# Altium schematic sheet analog-encoder.SchDoc: Encoder Interface INC/1Vpp/Resolver
size A3; SheetNumber: 9; SheetTotal: 18
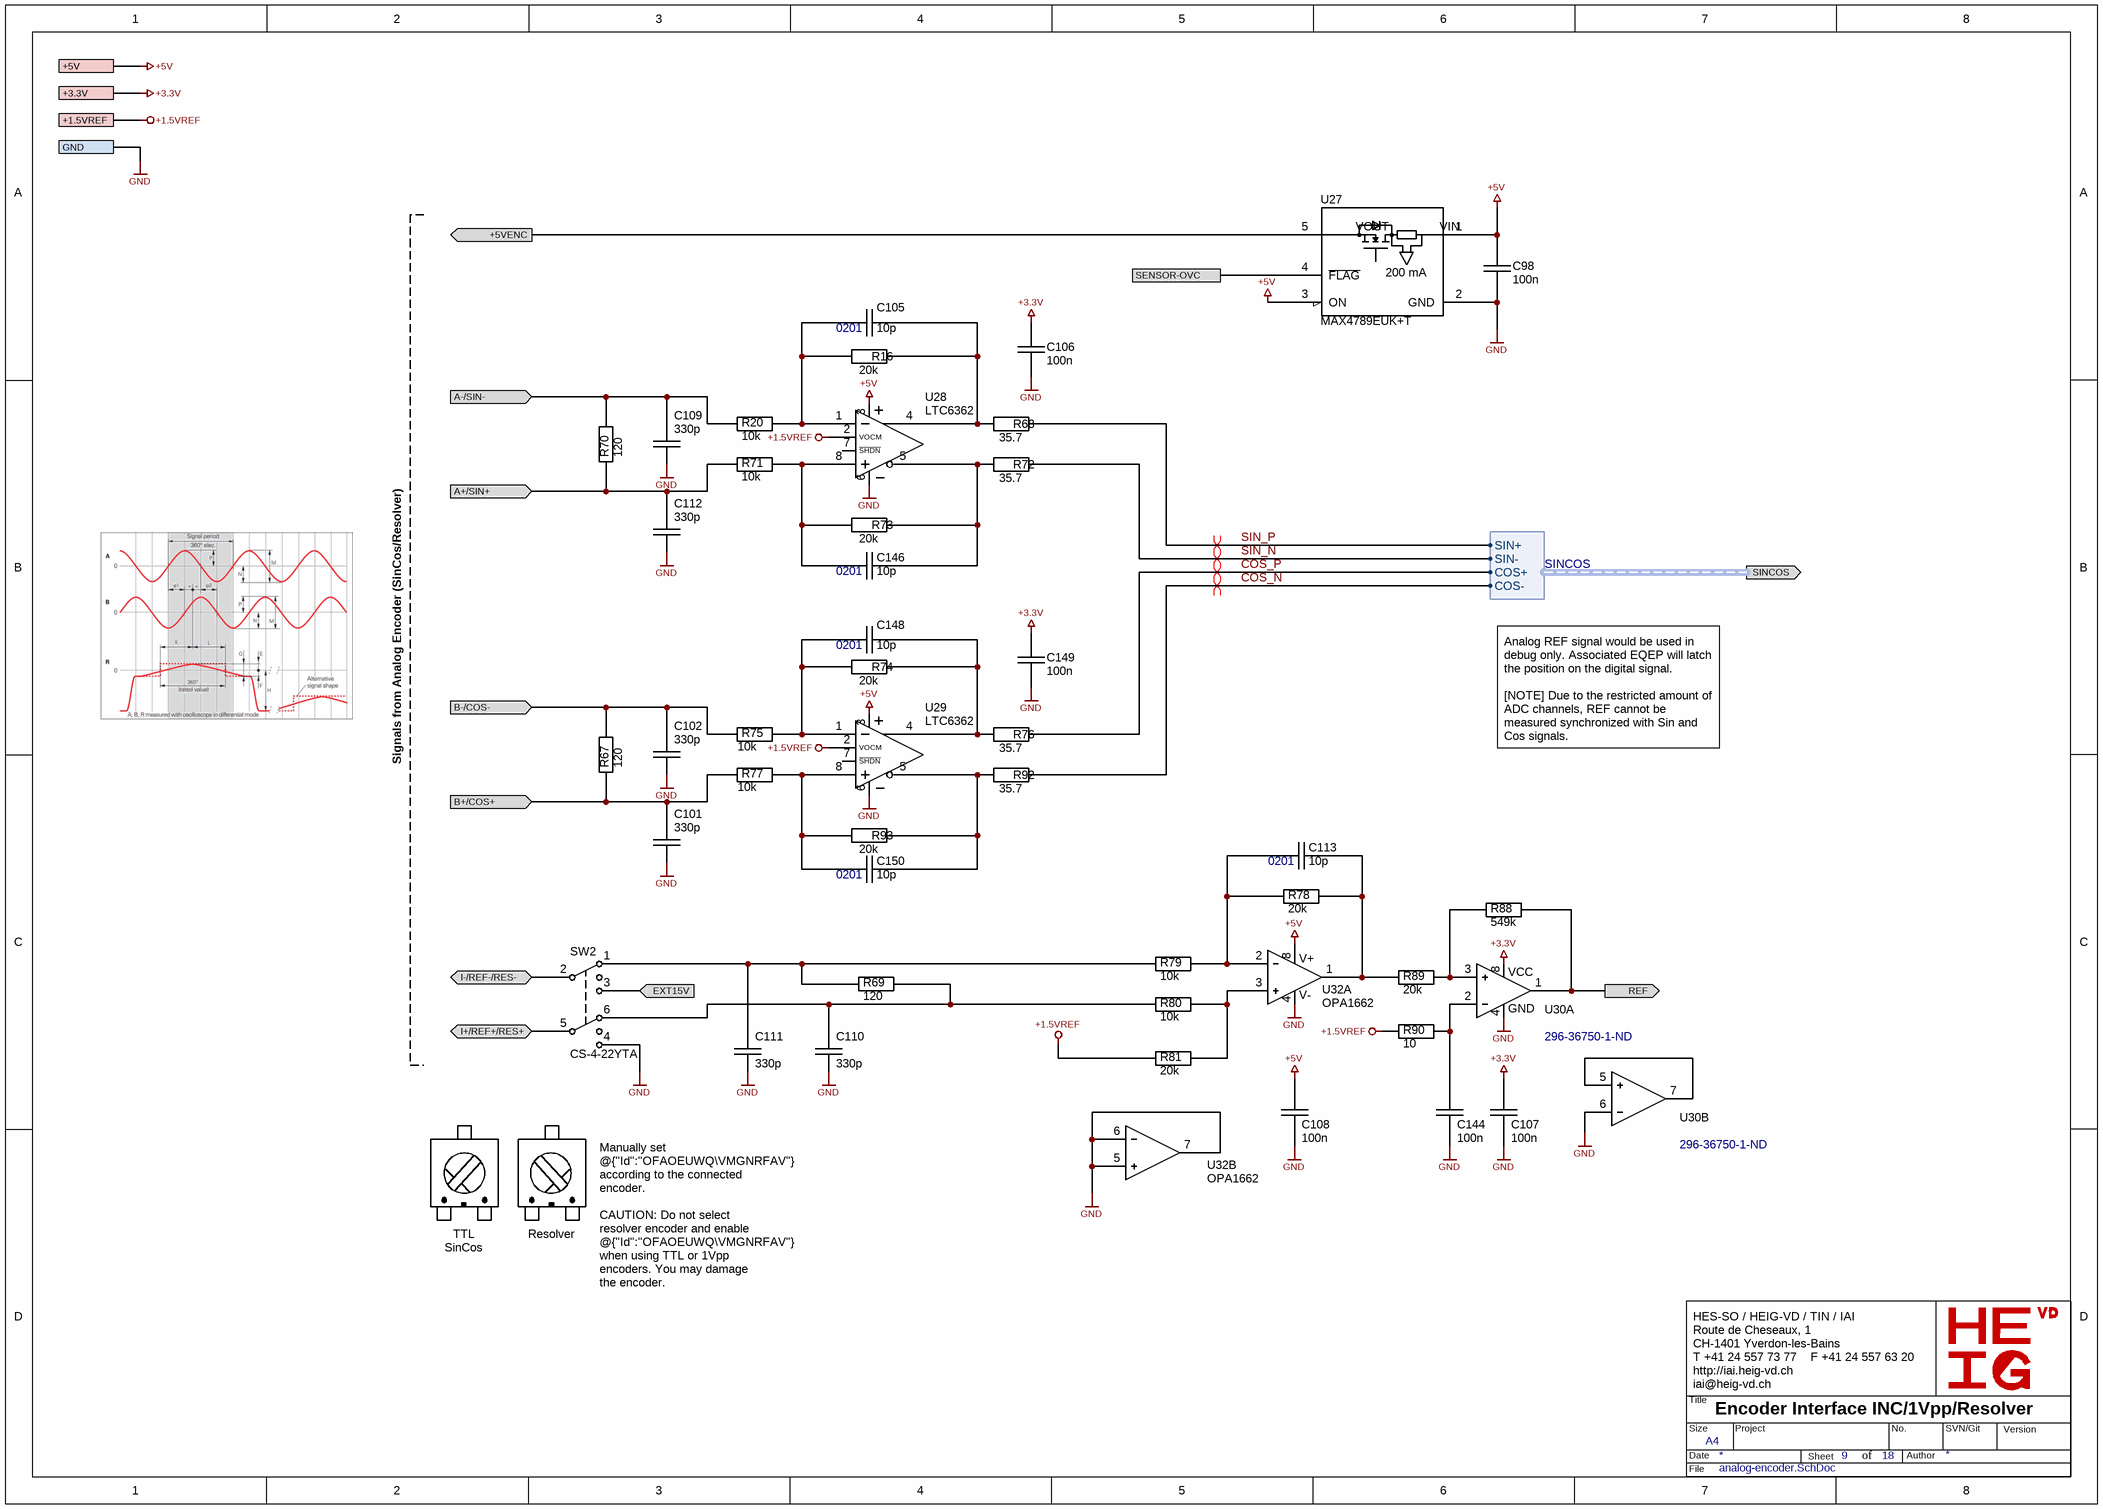
[diagram p0: analog-encoder.SchDoc]

## Parts
C98  100n  [SM/C0402]
C101  330p  [SM/C0402]
C102  330p  [SM/C0402]
C105  10p  Case: 0201  [SM/C0201]
C106  100n  [SM/C0402]
C107  100n  [SM/C0402]
C108  100n  [SM/C0402]
C109  330p  [SM/C0402]
C110  330p  [SM/C0402]
C111  330p  [SM/C0402]
C112  330p  [SM/C0402]
C113  10p  Case: 0201  [SM/C0201]
C144  100n  [SM/C0402]
C146  10p  Case: 0201  [SM/C0201]
C148  10p  Case: 0201  [SM/C0201]
C149  100n  [SM/C0402]
C150  10p  Case: 0201  [SM/C0201]
R16  20k  [SM/R0402]
R20  10k  [SM/R0402]
R67  120  [SM/R0402]
R68  35.7  [SM/R0402]
R69  120  [SM/R0402]
R70  120  [SM/R0402]
R71  10k  [SM/R0402]
R72  35.7  [SM/R0402]
R73  20k  [SM/R0402]
R74  20k  [SM/R0402]
R75  10k  [SM/R0402]
R76  35.7  [SM/R0402]
R77  10k  [SM/R0402]
R78  20k  [SM/R0402]
R79  10k  [SM/R0402]
R80  10k  [SM/R0402]
R81  20k  [SM/R0402]
R88  549k  [SM/R0402]
R89  20k  [SM/R0402]
R90  10  [SM/R0402]
R92  35.7  [SM/R0402]
R93  20k  [SM/R0402]
SW2  CS-4-22YTA  [CS-4-22YA]
U27  MAX4789EUK+T  [SOT23-5]
U28  LTC6362
U29  LTC6362
U30  Supplier Part Number 1: 296-36750-1-ND  (parts A,B of 2)
U32  OPA1662  [SOIC8]  (parts A,B of 2)

## Ports
+1.5VREF, +3.3V, +5V, +5VENC (out), A+/SIN+ (in), A-/SIN- (in), B+/COS+ (in), B-/COS- (in), EXT15V (in), GND, I+/REF+/RES+ (bidir), I-/REF-/RES- (bidir), REF (out), SENSOR-OVC, SINCOS (out, harness SINCOS)

## Harnesses
SINCOS: SIN+, COS+, SIN-, COS-

## Nets
+1.5VREF: R81.2 R90.2 U28.2(VOCM) U29.2(VOCM) ; port +1.5VREF
+3.3V: C106.2 C107.2 C149.2 U30.8(V+) ; port +3.3V
+5V: C98.1 C108.2 U27.1(VIN) U27.3(ON) U28.3(V+) U29.3(V+) U32.8(V+) ; port +5V
GND: C98.2 C101.2 C102.2 C106.1 C107.1 C108.1 C109.2 C110.2 C111.2 C112.2 C144.1 C149.1 SW2.4(2B) U27.2(GND) U28.6(V+) U29.6(V+) U30.4(GND) U30.6(IN-) U32.4(V-) U32.5(IN+) U32.6(IN-) U32.7(OUT) ; port GND
+5VENC: U27.5(VOUT) ; port +5VENC
A+/SIN+: C112.1 R70.2 R71.2 ; port A+/SIN+
A-/SIN-: C109.1 R20.2 R70.1 ; port A-/SIN-
B+/COS+: C101.1 R67.2 R77.2 ; port B+/COS+
B-/COS-: C102.1 R67.1 R75.2 ; port B-/COS-
COS_N: R92.1 ; port SINCOS.COS-
COS_P: R76.1 ; port SINCOS.COS+
EXT15V: SW2.3(1A) ; port EXT15V
I+/REF+/RES+: SW2.5(CB) ; port I+/REF+/RES+
I-/REF-/RES-: SW2.2(CA) ; port I-/REF-/RES-
REF: R88.1 U30.1(OUT) ; port REF
SENSOR-OVC: U27.4(~{FLAG}) ; port SENSOR-OVC
SIN_N: R72.1 ; port SINCOS.SIN-
SIN_P: R68.1 ; port SINCOS.SIN+
NetC105_1: C105.1 R16.1 R68.2 U28.4(OUT+)
NetC105_2: C105.2 R16.2 R20.1 U28.1(IN-)
NetC110_1: C110.1 R69.1 R80.2 SW2.6(1B)
NetC111_1: C111.1 R69.2 R79.2 SW2.1(2A)
NetC113_1: C113.1 R78.1 R89.2 U32.1(OUT)
NetC113_2: C113.2 R78.2 R79.1 U32.2(IN-)
NetC144_2: C144.2 R90.1 U30.2(IN-)
NetC146_1: C146.1 R72.2 R73.1 U28.5(OUT-)
NetC146_2: C146.2 R71.1 R73.2 U28.8(IN+)
NetC148_1: C148.1 R74.1 R76.2 U29.4(OUT+)
NetC148_2: C148.2 R74.2 R75.1 U29.1(IN-)
NetC150_1: C150.1 R92.2 R93.1 U29.5(OUT-)
NetC150_2: C150.2 R77.1 R93.2 U29.8(IN+)
NetR80_1: R80.1 R81.1 U32.3(IN+)
NetR88_2: R88.2 R89.1 U30.3(IN+)
NetU30_5: U30.5(IN+) U30.7(OUT)

Not connected (* = marked no-connect by the designer): U28 7(~{SHDN}); U29 7(~{SHDN})

## Layout directives
differential pair: COS_N, COS_P, SIN_N, SIN_P

## Notes on the sheet
- Signals from Analog Encoder (SinCos/Resolver)
- Analog REF signal would be used in debug only. Associated EQEP will latch the position on the digital signal.
  [NOTE] Due to the restricted amount of ADC channels, REF cannot be measured synchronized with Sin and Cos signals.
- SinCos
- TTL
- Resolver
- Manually set @{"Id":"OFAOEUWQ\VMGNRFAV"} according to the connected encoder.
  CAUTION: Do not select resolver encoder and enable @{"Id":"OFAOEUWQ\VMGNRFAV"} when using TTL or 1Vpp encoders. You may damage the encoder.
- HES-SO / HEIG-VD / TIN / IAI
  Route de Cheseaux, 1
  CH-1401 Yverdon-les-Bains
  T +41 24 557 73 77    F +41 24 557 63 20
  http://iai.heig-vd.ch
  iai@heig-vd.ch
- Title
- Size
- Date
- A4
- Project
- Sheet
- of
- No.
- Author
- SVN/Git
- Version
- File
- (in symbol MAX4789) 200 mA
- (in symbol TLV3201, part A) VCC

## Library data of the parts
C98 C106-C108 C144 C149 = CAP CER 100NF 25V X5R 0402: 100 nF ±10% 25V Ceramic Capacitor X5R 0402 (1005 Metric); Voltage: 25V; Dielectric: X5R; Supplier 1: Digi-Key; Supplier Part Number 1: 1276-1043-1-ND; Value: 100n
C101 C102 C109-C112 = CAP CER 330PF 50V C0G/NP0 0402: 330 pF ±5% 50V Ceramic Capacitor C0G, NP0 0402 (1005 Metric); Dielectric: NPO; Voltage: 50V; Supplier 1: Digi-Key; Supplier Part Number 1: 490-4928-1-ND; Value: 330p
C105 C113 C146 C148 C150 = CAP CER 10PF 25V C0G/NP0 0201: 10 pF ±5% 25V Ceramic Capacitor C0G, NP0 0201 (0603 Metric); Dielectric: X7R; Voltage: 25V; Supplier 1: Digi-Key; Supplier Part Number 1: 490-8607-1-ND; Value: 10p
R16 R68 R72-R74 R76 R78 R81 R89 R92 R93 = RES 20K OHM 1% 1/16W 0402: 20 kOhms ±1% 0.063W, 1/16W Chip Resistor 0402 (1005 Metric) Moisture Resistant Thick Film; Supplier 1: Digi-Key; Supplier Part Number 1: 311-20.0KLRCT-ND
  R16 R73 R74 R78 R81 R89 R93: Value: 20k
  R68 R72 R76 R92: Value: 35.7
R20 R71 R75 R77 R79 R80 = RES 10K OHM 1% 1/16W 0402: 10 kOhms ±1% 0.063W, 1/16W Chip Resistor 0402 (1005 Metric) Moisture Resistant Thick Film; Supplier 1: Digi-Key; Supplier Part Number 1: 1276-3431-1-ND; Value: 10k
R67 R69 R70 = RES 120 OHM 1% 1/16W 0402: 120 Ohms ±1% 0.063W, 1/16W Chip Resistor 0402 (1005 Metric) Moisture Resistant Thick Film; Supplier 1: Digi-Key; Supplier Part Number 1: 311-120LRCT-ND; Value: 120
R88 R90 = RES 20K OHM 1% 1/16W 0402: 20 kOhms ±1% 0.063W, 1/16W Chip Resistor 0402 (1005 Metric) Moisture Resistant Thick Film; Value: 20k; Supplier 1: Digi-Key; Supplier Part Number 1: 311-20.0KLRCT-ND
SW2 = CS-4-22YTA: Dip Switch DPDT 2 Position Surface Mount Rotary for Tool Actuator 100mA 16VDC; Supplier 1: Digi-Key; Supplier Part Number 1: 563-1039-1-ND
U27 = MAX4789: Current Limiting Regulator 200mA SOT-23-5; Voltage: 2.3..5.5V; Supplier 1: Digi-Key; Supplier Part Number 1: MAX4789EUK+TCT-ND
U30 = TLV3201: Comparator General Purpose Push-Pull SOT-23-5 / IC COMPARATOR RRI SGL SOT23-5; Supplier 1: Digi-Key
U32 = OPA1662: Dual operational amplifier; Supplier 1: Digi-Key; Supplier Part Number 1: 296-36692-1-ND